# EAGLE design Jtracker (EAGLE 7.4.0)
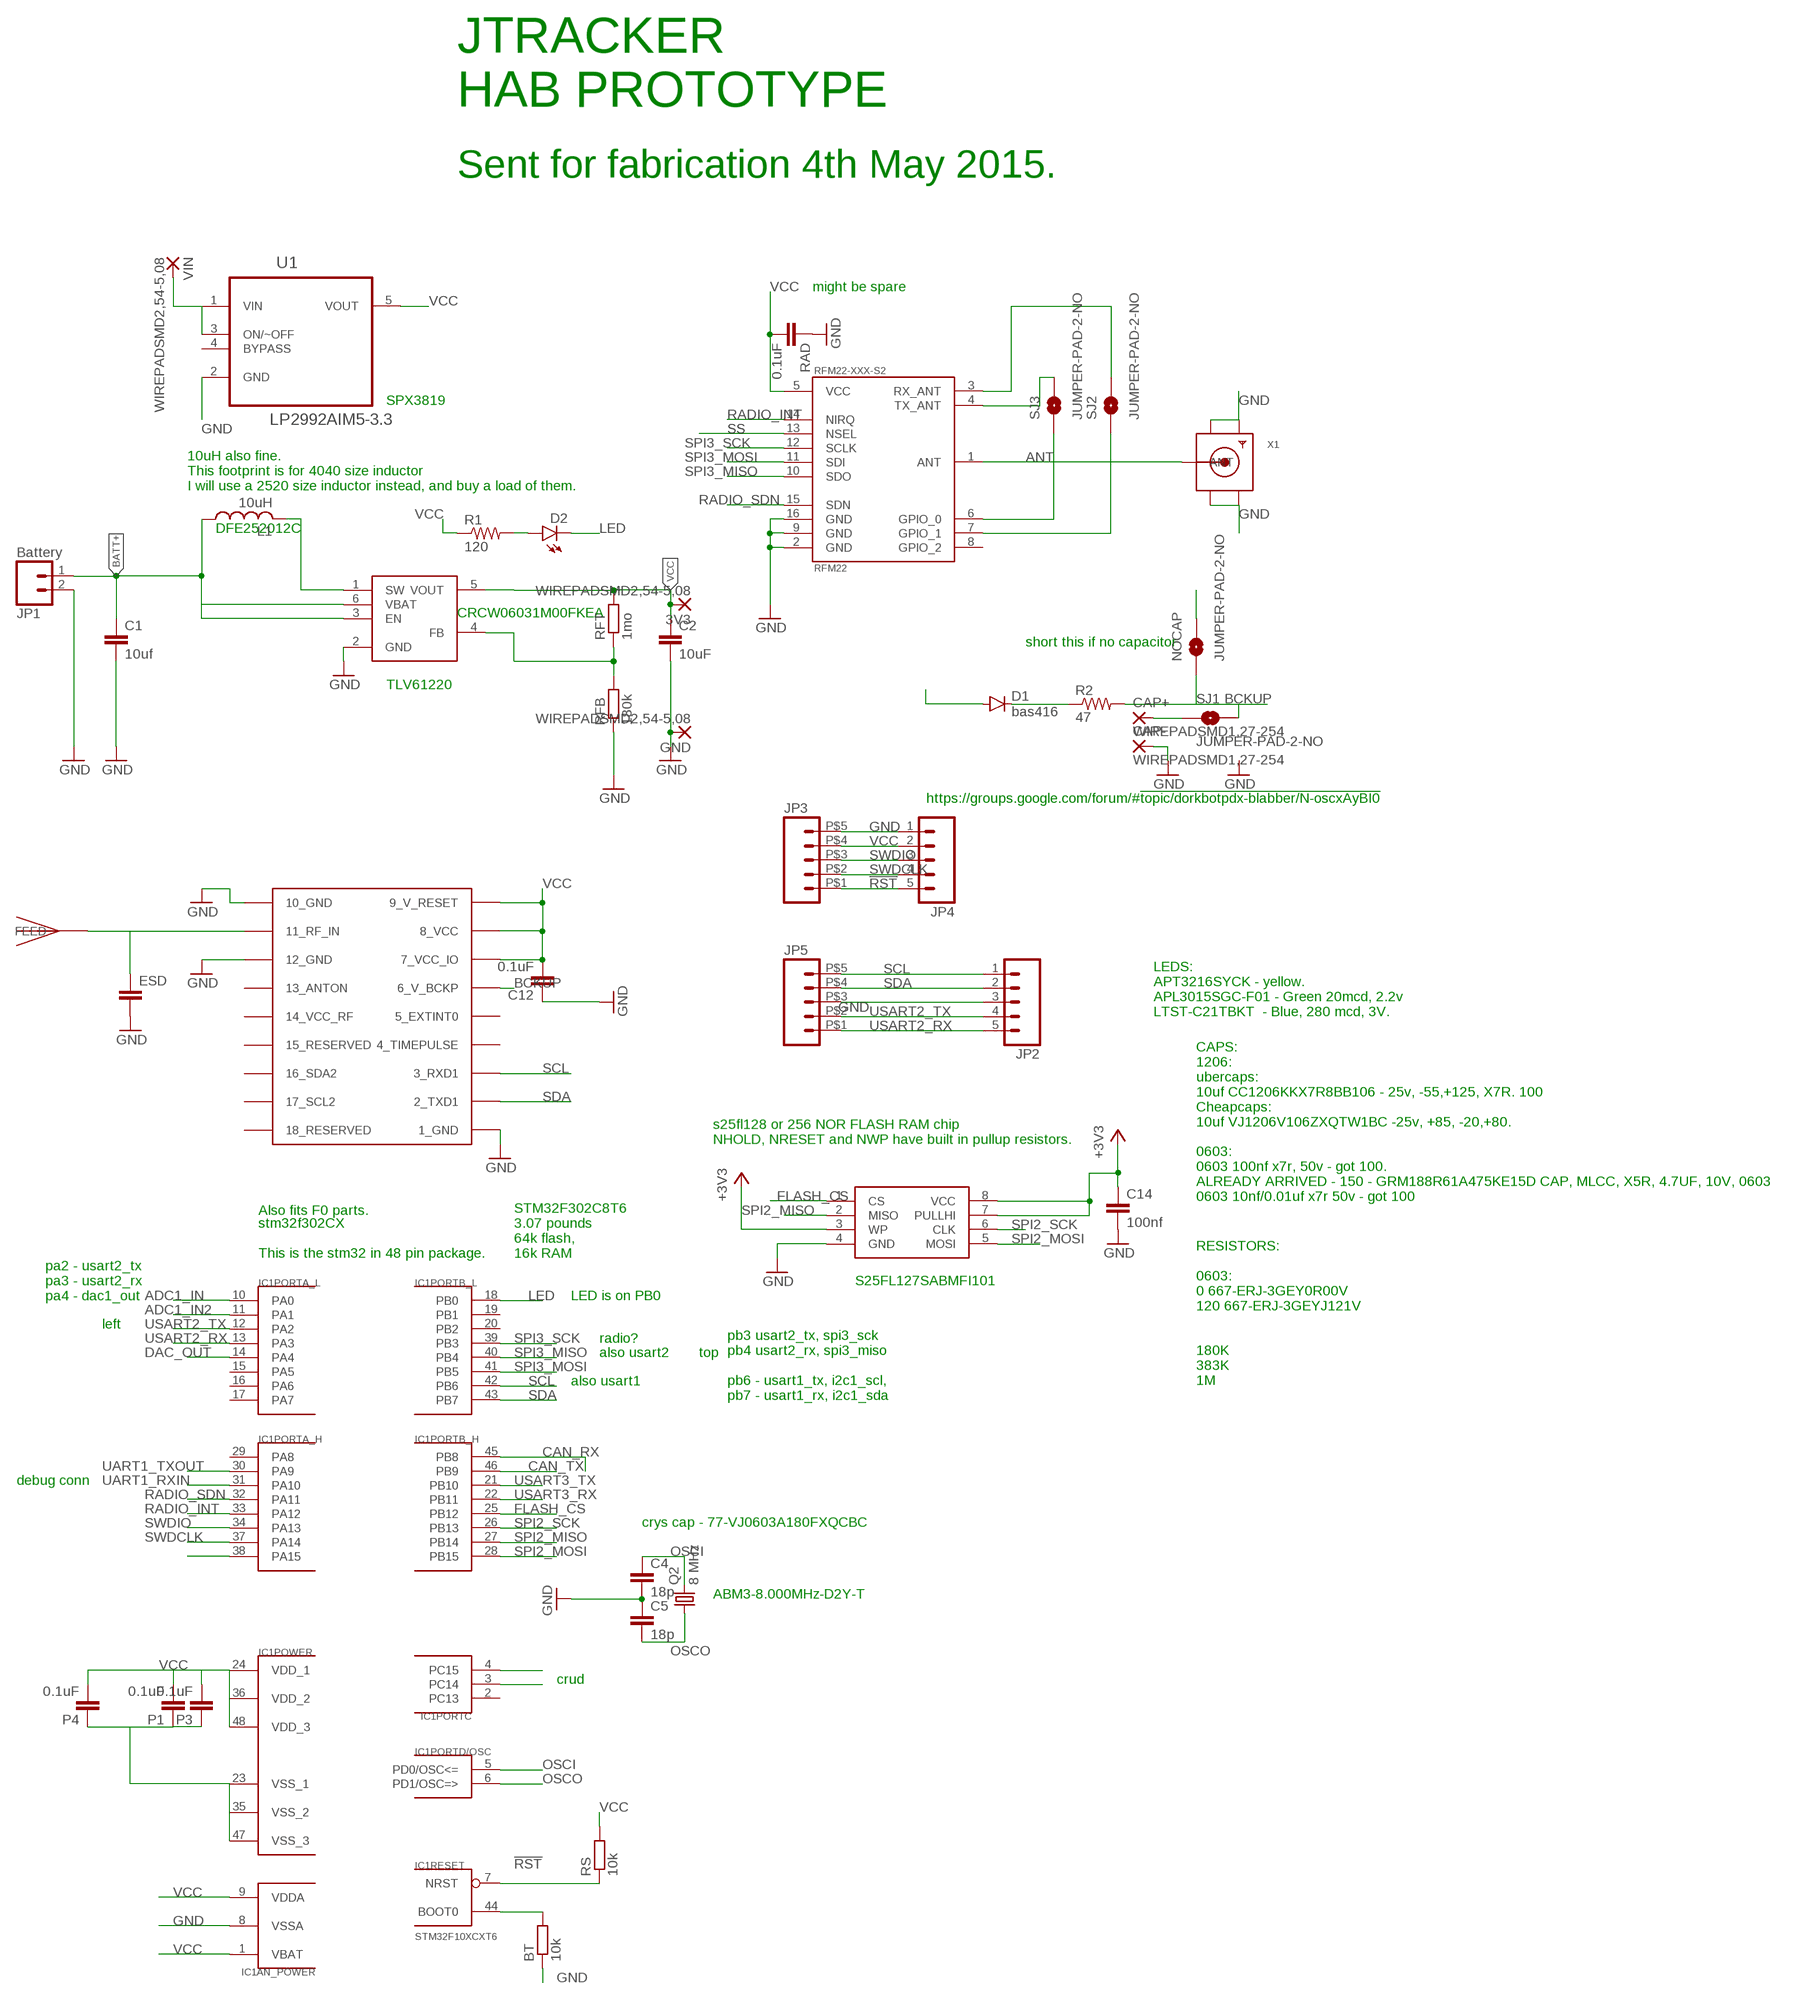
[diagram p0: schematic, sheet 1]

## Parts
3V3  WIREPADSMD2,54-5,08  [SMD2,54-5,08]
BT  10k  R-EU_R0603  [R0603]
C1  10uf  CAP1206  [1206]
C2  10uF  CAP1206  [1206]
C4  18p  C-EUC0603  [C0603]
C5  18p  C-EUC0603  [C0603]
C12  0.1uF  C-EUC0603  [C0603]
C14  100nf  CAP0603-CAP  [0603-CAP]
CAP+  WIREPADSMD1,27-254  [SMD1,27-2,54]
CAP-  WIREPADSMD1,27-254  [SMD1,27-2,54]
D1  bas416  DIODESOD123  [SOD-123]
D2  LED1206  [LED-1206]
ESD  CAP0603-CAP  [0603-CAP]
GND  WIREPADSMD2,54-5,08  [SMD2,54-5,08]
GPS_ANT  JTI_ANTENNA-1575AT43A40  [JTI_ANTENNA-1575AT43A40]
IC1  STM32F10XCXT6  [TQFP48]
JP1  Battery  M02PTH  [1X02]
JP2  M05NO_SILK  [1X05_NO_SILK]
JP3  M05  [5PADSMD]
JP4  M05NO_SILK  [1X05_NO_SILK]
JP5  M05  [5PADSMD]
L1  10uH  LLQH44P_P0  [LQH44]
MEM  S25FL127S_SOIC  [SOIC-8W]
NOCAP  JUMPER-PAD-2-NO  [PAD-JUMPER-2-NO_NO_SILK]
P1  0.1uF  C-EUC0603  [C0603]
P3  0.1uF  C-EUC0603  [C0603]
P4  0.1uF  C-EUC0603  [C0603]
Q2  8 MHz  ABRACON_ABM3_CRYSTAL  [ABRACON_ABM3_CRYSTAL]
R1  120  RESISTOR0603-RES  [0603-RES]
R2  47  RESISTOR0603-RES  [0603-RES]
RAD  0.1uF  C-EUC0603  [C0603]
RFB  180k  R-EU_R0603  [R0603]
RFM22-XXX-S2  RFM22  [RFM22-XXX-S2]
RFT  1mo  R-EU_R0603  [R0603]
RS  10k  R-EU_R0603  [R0603]
SJ1  JUMPER-PAD-2-NO  [PAD-JUMPER-2-NO_NO_SILK]
SJ2  JUMPER-PAD-2-NO  [PAD-JUMPER-2-NO_NO_SILK]
SJ3  JUMPER-PAD-2-NO  [PAD-JUMPER-2-NO_NO_SILK]
U1  LP2992AIM5-3.3  [SOT95P284X122-5N]
U$2  TLV61220  [SOT23-6]
U$3  UBLOX_MAX  [UBLOX_MAX]
VIN  WIREPADSMD2,54-5,08  [SMD2,54-5,08]
X1  SMACONNECTOR_EDGE_UFL  [SMA_EDGELAUNCH_UFL]

## Nets
!RST: IC1.7(RESET:NRST) JP3.P$1 JP4.5 RS.1
+3V3 [vcc]: MEM.3(WP)
ADC1_IN: IC1.10(PORTA_L:PA0)
ADC1_IN2: IC1.11(PORTA_L:PA1)
ANT [rf]: RFM22-XXX-S2.1(ANT) X1.P(ANT)
BATT+ [vcc]: C1.1 JP1.1 L1.P$1 U$2.3(EN) U$2.6(VBAT)
BCKUP: NOCAP.1 R2.2 SJ1.2 U$3.6_V_BCKP
CAN_RX: IC1.45(PORTB_H:PB8)
CAN_TX: IC1.46(PORTB_H:PB9)
DAC_OUT: IC1.14(PORTA_L:PA4)
FLASH_CS: IC1.25(PORTB_H:PB12) MEM.1(CS)
GND: BT.1 C1.2 C2.2 C4.2 C5.1 C12.1 C14.2 CAP-.1(P) ESD.2 GND.1(P) IC1.8(AN_POWER:VSSA) IC1.23(POWER:VSS_1) IC1.35(POWER:VSS_2) IC1.47(POWER:VSS_3) JP1.2 JP2.3 JP3.P$5 JP4.1 JP5.P$3 MEM.4(GND) P1.1 P3.1 P4.1 RAD.1 RFB.1 RFM22-XXX-S2.2(GND) RFM22-XXX-S2.9(GND) RFM22-XXX-S2.16(GND) U1.2(GND) U$2.2(GND) U$3.1_GND U$3.10_GND U$3.12_GND X1.GND@1(GND1) X1.GND@2(GND2) X1.GND@3(GND3) X1.GND@4(GND4)
GPS_ANT [rf]: ESD.1 GPS_ANT.FEED U$3.11_RF_IN
LED: D2.C IC1.18(PORTB_L:PB0)
N$1: D1.C R2.1
N$2: IC1.3(PORTC:PC14)
N$3: U1.1(VIN) U1.3(ON/~OFF) VIN.1(P)
N$4: IC1.4(PORTC:PC15)
N$5: BT.2 IC1.44(RESET:BOOT0)
N$6: RFM22-XXX-S2.4(TX_ANT) SJ3.2
N$7: RFM22-XXX-S2.3(RX_ANT) SJ2.2
N$8: L1.P$2 U$2.1(SW)
N$9: CAP+.1(P) SJ1.1
N$10: RFM22-XXX-S2.7(GPIO_1) SJ2.1
N$11: RFB.2 RFT.1 U$2.4(FB)
N$12: RFM22-XXX-S2.6(GPIO_0) SJ3.1
N$13: D2.A R1.2
OSCI: C4.1 IC1.5(PORTD/OSC:PD0/OSC<=) Q2.P$2
OSCO: C5.2 IC1.6(PORTD/OSC:PD1/OSC=>) Q2.P$1
RADIO_INT: IC1.33(PORTA_H:PA12) RFM22-XXX-S2.14(NIRQ)
RADIO_SDN: IC1.32(PORTA_H:PA11) RFM22-XXX-S2.15(SDN)
SCL: IC1.42(PORTB_L:PB6) JP2.1 JP5.P$5 U$3.3_RXD1
SDA: IC1.43(PORTB_L:PB7) JP2.2 JP5.P$4 U$3.2_TXD1
SPI2_MISO: IC1.27(PORTB_H:PB14) MEM.2(MISO)
SPI2_MOSI: IC1.28(PORTB_H:PB15) MEM.5(MOSI)
SPI2_SCK: IC1.26(PORTB_H:PB13) MEM.6(CLK)
SPI3_MISO: IC1.40(PORTB_L:PB4) RFM22-XXX-S2.10(SDO)
SPI3_MOSI: IC1.41(PORTB_L:PB5) RFM22-XXX-S2.11(SDI)
SPI3_SCK: IC1.39(PORTB_L:PB3) RFM22-XXX-S2.12(SCLK)
SS: IC1.38(PORTA_H:PA15) RFM22-XXX-S2.13(NSEL)
SWDCLK: IC1.37(PORTA_H:PA14) JP3.P$2 JP4.4
SWDIO: IC1.34(PORTA_H:PA13) JP3.P$3 JP4.3
UART1_RXIN: IC1.31(PORTA_H:PA10)
UART1_TXOUT: IC1.30(PORTA_H:PA9)
USART2_RX: IC1.13(PORTA_L:PA3) JP2.5 JP5.P$1
USART2_TX: IC1.12(PORTA_L:PA2) JP2.4 JP5.P$2
USART3_RX: IC1.22(PORTB_H:PB11)
USART3_TX: IC1.21(PORTB_H:PB10)
VCC: 3V3.1(P) C2.1 C12.2 C14.1 D1.A IC1.1(AN_POWER:VBAT) IC1.9(AN_POWER:VDDA) IC1.24(POWER:VDD_1) IC1.36(POWER:VDD_2) IC1.48(POWER:VDD_3) JP3.P$4 JP4.2 MEM.7(PULLHI) MEM.8(VCC) NOCAP.2 P1.2 P3.2 P4.2 R1.1 RAD.2 RFM22-XXX-S2.5(VCC) RFT.2 RS.2 U1.5(VOUT) U$2.5(VOUT) U$3.7_VCC_IO U$3.8_VCC U$3.9_V_RESET ; supply symbol labelled +3V3
Unconnected: IC1.2(PORTC:PC13) IC1.15(PORTA_L:PA5) IC1.16(PORTA_L:PA6) IC1.17(PORTA_L:PA7) IC1.19(PORTB_L:PB1) IC1.20(PORTB_L:PB2) IC1.29(PORTA_H:PA8) RFM22-XXX-S2.8(GPIO_2) U1.4(BYPASS) U$3.4_TIMEPULSE U$3.5_EXTINT0 U$3.13_ANTON U$3.14_VCC_RF U$3.15_RESERVED U$3.16_SDA2 U$3.17_SCL2 U$3.18_RESERVED

## Notes on the sheet
- JTRACKER 
  HAB PROTOTYPE
- Sent for fabrication 4th May 2015.
- might be spare
- SPX3819
- 10uH also fine. 
  This footprint is for 4040 size inductor
  I will use a 2520 size inductor instead, and buy a load of them.
- DFE252012C
- CRCW06031M00FKEA
- short this if no capacitor
- TLV61220
- https://groups.google.com/forum/#!topic/dorkbotpdx-blabber/N-oscxAyBI0
- LEDS:
  APT3216SYCK - yellow. 
  APL3015SGC-F01 - Green 20mcd, 2.2v
  LTST-C21TBKT  - Blue, 280 mcd, 3V.
- s25fl128 or 256 NOR FLASH RAM chip
  NHOLD, NRESET and NWP have built in pullup resistors.
- CAPS:
  1206:
  ubercaps:
  10uf CC1206KKX7R8BB106 - 25v, -55,+125, X7R. 100
  Cheapcaps:
  10uf VJ1206V106ZXQTW1BC -25v, +85, -20,+80.
  
  0603:
  0603 100nf x7r, 50v - got 100. 
  ALREADY ARRIVED - 150 - GRM188R61A475KE15D CAP, MLCC, X5R, 4.7UF, 10V, 0603
  0603 10nf/0.01uf x7r 50v - got 100
- Also fits F0 parts.
- stm32f302CX
  
  This is the stm32 in 48 pin package.
- STM32F302C8T6 
  3.07 pounds
  64k flash,
  16k RAM
- pa2 - usart2_tx
  pa3 - usart2_rx
  pa4 - dac1_out
- LED is on PB0 | S25FL127SABMFI101
- left
- radio?
- also usart2 | top
- also usart1
- pb3 usart2_tx, spi3_sck
  pb4 usart2_rx, spi3_miso
  
  pb6 - usart1_tx, i2c1_scl,
  pb7 - usart1_rx, i2c1_sda
- RESISTORS:
  
  0603:
  0 667-ERJ-3GEY0R00V 
  120 667-ERJ-3GEYJ121V 
  
  
  180K
  383K
  1M
- debug conn
- crys cap - 77-VJ0603A180FXQCBC
- ABM3-8.000MHz-D2Y-T
- crud

## Library data of the parts
3V3 CAP+ CAP- GND VIN = wirepad:WIREPAD: Wire PAD connect wire on PCB
BT RFB RFT RS = resistor:R-EU_: RESISTOR, European symbol
C1 C2 C14 ESD = SparkFun-Capacitors:CAP: Capacitor Standard 0603 ceramic capacitor, and 0.1" leaded capacitor.
C4 C5 C12 P1 P3 P4 RAD = resistor:C-EU: CAPACITOR, European symbol
D1 = SparkFun-DiscreteSemi:DIODE: Diode These are standard reverse protection diodes and small signal diodes. SMA package can handle up to about 1A. SOD-323 can handle about 200mA. What the SOD-323 package when ordering, there are some mfgs out there that are 5-pin packages.
D2 = SparkFun-LED:LED: LEDs Standard schematic elements and footprints for 5mm, 3mm, 1206, and 0603 sized LEDs. 5mm - Spark Fun Electronics SKU : COM-00529 (and others)
GPS_ANT = ava:JTI_ANTENNA-1575AT43A40
IC1 = stm32:STM32F10XCXT6: ST STM32F101/103 48pin LQFP
JP1 = SparkFun:M02: Header 2 Standard 2-pin 0.1" header. Use with straight break away headers (SKU : PRT-00116), right angle break away headers (PRT-00553), swiss pins (PRT-00743), machine pins (PRT-00117), and female headers (PRT-00115). Molex polarized connector foot print use with SKU : PRT-08233 with associated crimp pins and housings.
JP2-JP5 = James:M05: Header 5 Standard 5-pin 0.1" header. Use with straight break away headers (SKU : PRT-00116), right angle break away headers (PRT-00553), swiss pins (PRT-00743), machine pins (PRT-00117), and female headers (PRT-00115). Molex polarized connector foot print use with SKU : PRT-08230 with associated crimp pins and housings.
L1 = karlnet-parts:L
MEM = James:S25FL127S_SOIC: S25FL127S 128MB FLASH MEMORY
NOCAP SJ1-SJ3 = SparkFun-Passives:JUMPER-PAD-2-NO
Q2 = ava:ABRACON_ABM3_CRYSTAL
R1 R2 = SparkFun-Passives:RESISTOR: Resistor Basic schematic elements and footprints for 0603, 1206, and PTH resistors.
RFM22-XXX-S2 = SparkFun:RFM22: *Hope RF's RFM22* Packages: RFM22-S2 (SMD)
U1 = James:LP2992AIM5-3.3: Low-Dropout Regulator; MPN: LP2992AIM5-3.3; OC_FARNELL: 1469139; OC_NEWARK: 74C5317; PACKAGE: SOT23-5; SUPPLIER: National Semiconductor
U$2 = James:TLV61220: TLV61220 boost converter sot23 james
U$3 = ava:UBLOX_MAX: UBLOX MAX
X1 = adafruit:SMACONNECTOR: SMA Connector 90° DIP SMA Connector, 50 Ohm (4UConnector: 07259)

## Net classes
0 default: width 0.152 mm, clearance 0.254 mm
1 vcc: width 0.254 mm

## Board
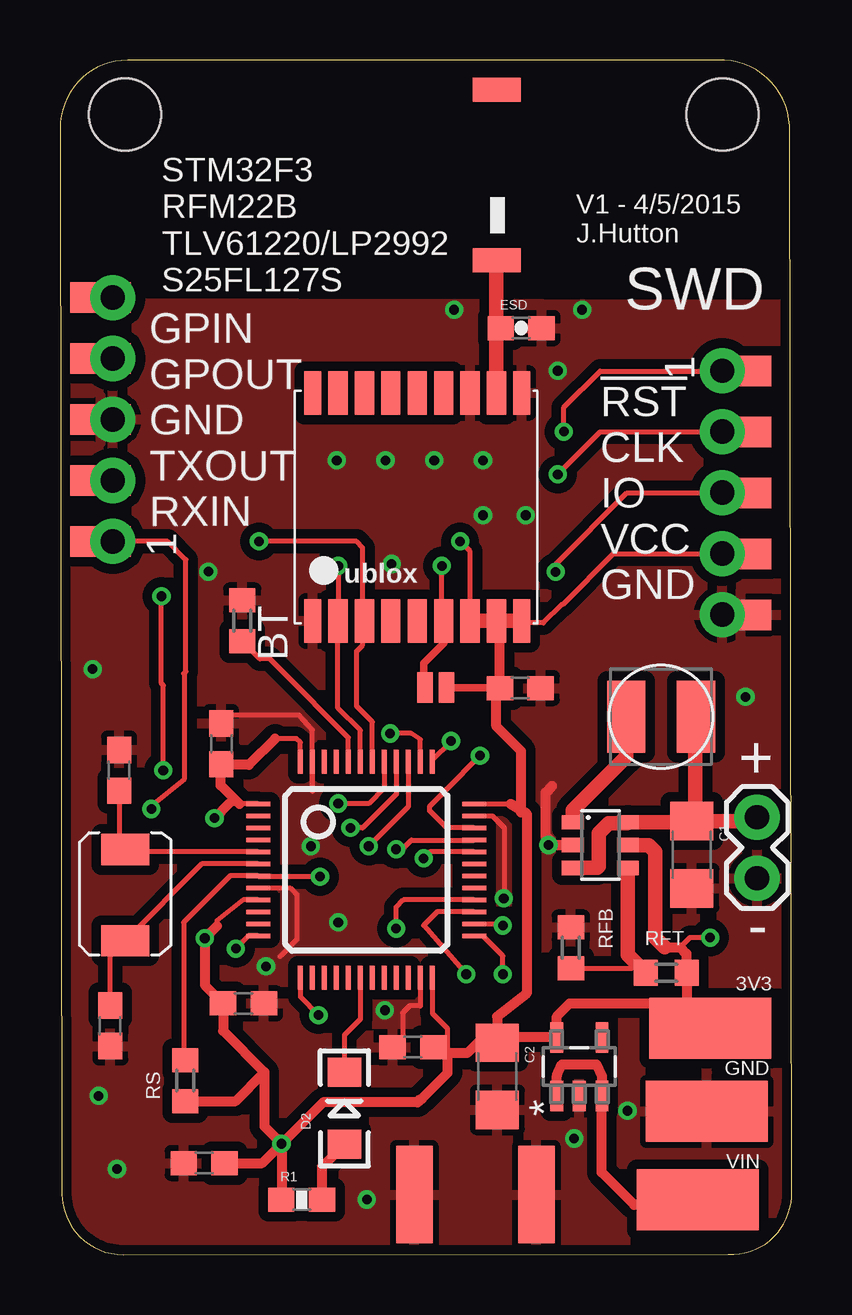
[diagram p1: board, top side]
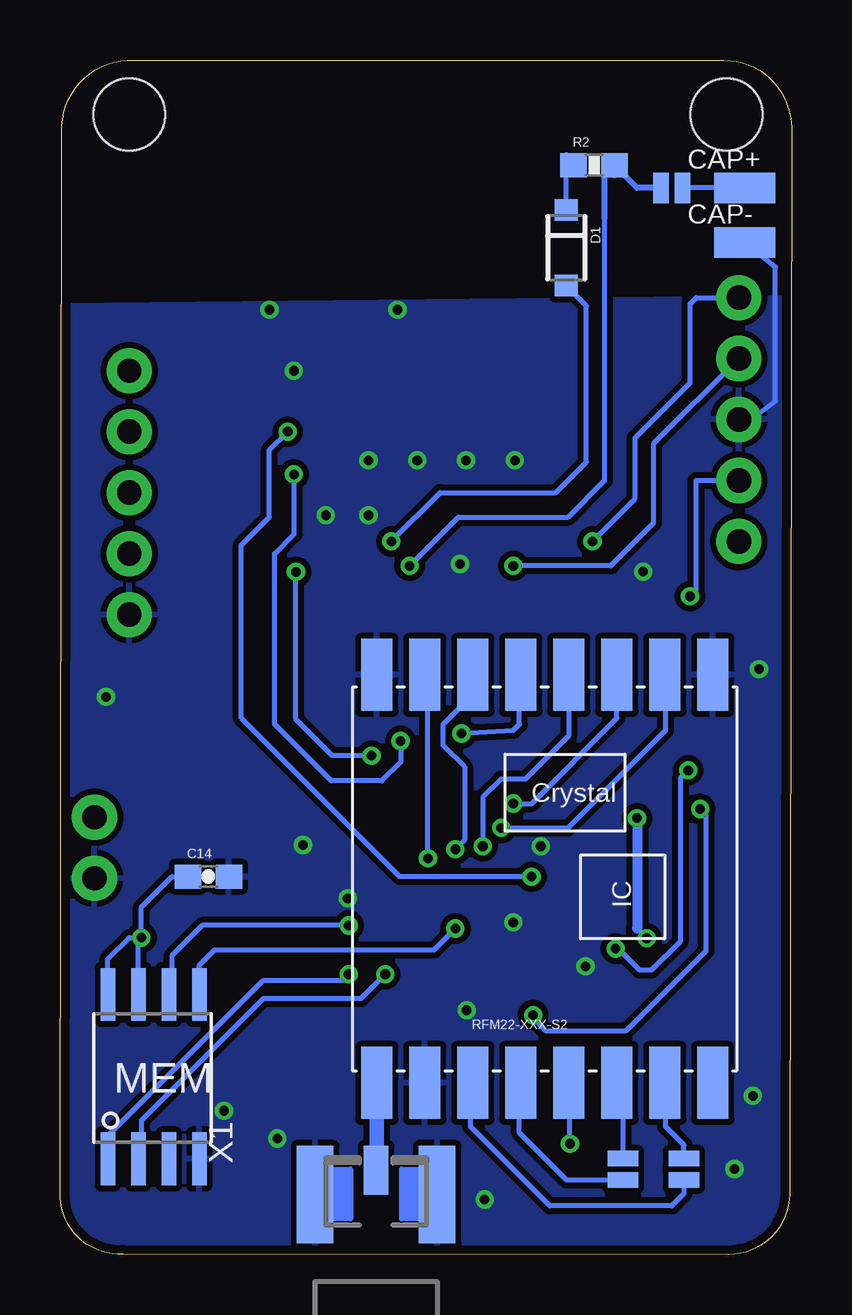
[diagram p2: board, bottom side, seen from below]

Size 30.48 x 49.78 mm. Coordinates in mm from the lower left corner, seen from the top.
Outline: 0,46.94 0.08,2.54 arc90 2.63,0 27.85,0.01 arc90 30.48,2.4 30.4,47.03 arc90 27.4,49.78 2.82,49.77 arc90 0,46.94
Copper layers (1*16): Top 0.0356mm / dielectric 1.5011mm / Bottom 0.0356mm
Design rules "LaenPCBOrder": minimum track width 6mil, minimum drill 13mil, track to track 6mil, track to pad 6mil, pad to pad 6mil, via to via 6mil, smd to smd 6mil, copper to edge 15mil, drill to drill 6mil, minimum pad ring 7mil, minimum via ring 7mil, stop-mask expansion 3mil, vias tented up to drill 0mil, thermal gap 10mil
Holes 3 mm at 27.6,47.5 2.7,47.5

### Footprints (pad centres in the part's own frame; a part is rotated, then mirrored left to right if it is on the bottom)
SMD2,54-5,08 = smd 2.54 x 5.08: 1 0,0
R0603 = smd 1 x 1.1: 1 -0.85,0; 2 0.85,0
1206 = smd 1.6 x 1.8: 1 -1.4,0; 2 1.4,0
C0603 = smd 1.1 x 1: 1 -0.85,0; 2 0.85,0
0603-CAP = smd 1.1 x 1: 1 -0.85,0; 2 0.85,0
SMD1,27-2,54 = smd 1.27 x 2.54: 1 0,0
SOD-123 = smd 0.9 x 0.95: A 1.575,0; C -1.575,0
LED-1206 = smd 1.2 x 1.4: A -1.5,0; C 1.5,0
JTI_ANTENNA-1575AT43A40 = smd 1 x 2: FEED -3.175,0; NC 3.925,0
TQFP48 = smd 0.2 x 1: 1 -2.75,-4.5; 2 -2.25,-4.5; 3 -1.75,-4.5; 4 -1.25,-4.5; 5 -0.75,-4.5; 6 -0.25,-4.5; 7 0.25,-4.5; 8 0.75,-4.5; 9 1.25,-4.5; 10 1.75,-4.5; 11 2.25,-4.5; 12 2.75,-4.5; 25 2.75,4.5; 26 2.25,4.5; 27 1.75,4.5; 28 1.25,4.5; 29 0.75,4.5; 30 0.25,4.5; 31 -0.25,4.5; 32 -0.75,4.5; 33 -1.25,4.5; 34 -1.75,4.5; 35 -2.25,4.5; 36 -2.75,4.5 | smd 1 x 0.2: 13 4.5,-2.75; 14 4.5,-2.25; 15 4.5,-1.75; 16 4.5,-1.25; 17 4.5,-0.75; 18 4.5,-0.25; 19 4.5,0.25; 20 4.5,0.75; 21 4.5,1.25; 22 4.5,1.75; 23 4.5,2.25; 24 4.5,2.75; 37 -4.5,2.75; 38 -4.5,2.25; 39 -4.5,1.75; 40 -4.5,1.25; 41 -4.5,0.75; 42 -4.5,0.25; 43 -4.5,-0.25; 44 -4.5,-0.75; 45 -4.5,-1.25; 46 -4.5,-1.75; 47 -4.5,-2.25; 48 -4.5,-2.75
1X02 = drill 1.016 pad 1.88: 1 0,0; 2 2.54,0
1X05_NO_SILK = drill 1.016 pad 1.88: 1 0,0; 2 2.54,0; 3 5.08,0; 4 7.62,0; 5 10.16,0
5PADSMD = smd 1.27 x 2.54: P$1 -5.08,1.27; P$2 -2.54,1.27; P$3 0,1.27; P$4 2.54,1.27; P$5 5.08,1.27
LQH44 = smd 1.6 x 3: P$1 -1.45,0; P$2 1.45,0
SOIC-8W = smd 0.6 x 2.2: 1 -1.905,-3.376; 2 -0.635,-3.376; 3 0.635,-3.376; 4 1.905,-3.376; 5 1.905,3.475; 6 0.635,3.475; 7 -0.635,3.475; 8 -1.905,3.475
PAD-JUMPER-2-NO_NO_SILK = smd 0.635 x 1.27: 1 -0.45,0; 2 0.45,0
ABRACON_ABM3_CRYSTAL = smd 1.3 x 2: P$1 -3.4,0.1; P$2 0.4,0.1
0603-RES = smd 1.1 x 1: 1 -0.85,0; 2 0.85,0
RFM22-XXX-S2 = smd 3 x 1.3: 1 -8.5,7; 2 -8.5,5; 3 -8.5,3; 4 -8.5,1; 5 -8.5,-1; 6 -8.5,-3; 7 -8.5,-5; 8 -8.5,-7; 9 8.5,-7; 10 8.5,-5; 11 8.5,-3; 12 8.5,-1; 13 8.5,1; 14 8.5,3; 15 8.5,5; 16 8.5,7
SOT95P284X122-5N = smd 1.27 x 0.533: 1 -1.219,0.94; 2 -1.219,0; 3 -1.219,-0.94; 4 1.219,-0.94; 5 1.219,0.94
SOT23-6 = smd 0.6 x 0.9: 1 -0.95,-1.15; 2 0,-1.15; 3 0.95,-1.15; 4 0.95,1.15; 5 0,1.15; 6 -0.95,1.15
UBLOX_MAX = smd 1.8 x 0.7: 1_GND 4.95,-4.4; 9_V_RESET 4.95,4.3; 10_GND -4.55,4.3; 18_RESERVED -4.55,-4.4 | smd 1.8 x 0.8: 2_TXD1 4.95,-3.35; 3_RXD1 4.95,-2.25; 4_TIMEPULSE 4.95,-1.15; 5_EXTINT0 4.95,-0.05; 6_V_BCKP 4.95,1.05; 7_VCC_IO 4.95,2.15; 8_VCC 4.95,3.25; 11_RF_IN -4.55,3.25; 12_GND -4.55,2.15; 13_ANTON -4.55,1.05; 14_VCC_RF -4.55,-0.05; 15_RESERVED -4.55,-1.15; 16_SDA2 -4.55,-2.25; 17_SCL2 -4.55,-3.35
SMA_EDGELAUNCH_UFL = smd 4.064 x 1.524: GND@1 2.032,-2.54; GND@2 2.032,2.54 | smd 4.064 x 1.524 bottom: GND@3 2.032,2.54; GND@4 2.032,-2.54 | smd 2.032 x 1.016: P 3.048,0

### Placement (x,y rotation side)
3V3  27.09,9.44 270 top
BT  7.59,26.41 270 top
C1  26.33,16.66 270 top
C2  18.22,7.43 270 top
C4  2.46,20.18 90 top
C5  2.09,9.54 90 top
C12  19.18,23.61 180 top
C14  24.29,15.75 0 bottom
CAP+  1.94,44.45 270 bottom
CAP-  1.94,42.16 270 bottom
D1  9.38,41.95 270 bottom
D2  11.85,6.09 90 top
ESD  19.21,38.61 0 top
GND  26.95,5.97 90 top
GPS_ANT  18.2,44.61 90 top
IC1  12.76,16.03 270 top
JP1  29.04,18.22 270 top
JP2  2.2,39.88 270 top
JP3  27.09,31.74 270 top
JP4  27.6,26.67 90 top
JP5  2.96,34.8 90 top
L1  25.04,22.41 180 top
MEM  26.58,7.36 0 bottom
NOCAP  15.66,23.62 0 top
P1  6.72,21.28 270 top
P3  14.71,8.65 0 top
P4  7.64,10.46 180 top
Q2  2.82,16.48 90 top
R1  10.07,2.28 0 top
R2  8.23,45.39 0 bottom
RAD  6.01,3.81 0 top
RFB  21.28,12.79 270 top
RFM22-XXX-S2  10.29,15.66 90 bottom
RFT  25.26,11.75 0 top
RS  5.22,7.25 270 top
SJ1  4.99,44.45 180 bottom
SJ2  4.48,3.55 270 bottom
SJ3  7.02,3.55 270 bottom
U1  21.64,7.83 90 top
U$2  22.52,17.07 270 top
U$3  14.93,31.35 270 top
VIN  26.58,2.28 270 top
X1  17.31,0.47 90 bottom

### Tracks (layer width: path | path; a pad name or v marks a point on that pad's centre or on a via)
!RST  (via drill 0.4)
  Top 0.2: RS.1 5.21,8.11 5.21,8.44 5.15,8.49 5.15,13.84 7.09,15.78 IC1.7 8.29,15.75 v10.83,15.75 | v20.99,34.29 20.99,35.3 22.5,36.82 JP3.P$1 27.61,36.82 JP4.5
  Bottom 0.2: v20.99,34.29 21.75,33.53 21.75,30.73 22.92,29.56 22.92,22.35 16.32,15.75 v10.83,15.75
ANT
  Bottom 0.6: RFM22-XXX-S2.1 17.29,3.22 X1.P
BATT+
  Top 0.61: C1.1 25.81,18.02 U$2.6 23.63,17.98 22.87,17.98 22.45,17.56 22.45,16.19 22.38,16.12 U$2.3 | C1.1 28.88,18.06 JP1.1 | L1.P$1 26.48,22.4 26.48,18.21 C1.1
BCKUP  (via drill 0.4)
  Top 0.2: U$3.6_V_BCKP 15.91,26.48 v15.91,28.7
  Top 0.305: U$3.6_V_BCKP 15.98,25.47 15.15,24.64 15.15,23.68 NOCAP.1
  Bottom 0.2: 7.78,43.18 7.78,32.26 9.31,30.73 13.88,30.73 v15.91,28.7
  Bottom 0.254: 7.38,44.96 R2.2 | 7.78,43.18 7.78,44.98 R2.2 | SJ1.2 6.44,44.45 R2.2
FLASH_CS  (via drill 0.4)
  Top 0.2: v18.45,11.68 18.45,12.44 17.62,13.28 IC1.25
  Bottom 0.2: MEM.1 28.48,4.95 22.01,11.43 18.71,11.43 v18.45,11.68
GND  (via drill 0.4)
  Top 0.2: P1.1 7.06,22.48 9.97,22.48 10.51,21.87 10.51,19.3 10.51,19.37 IC1.47 | IC1.23 15.01,10.36 | 15.01,10.36 | IC1.35 18.02,18.28 18.5,17.79 18.5,14.87 v18.49,14.84 | IC1.8 9.59,15.28 9.87,15 9.87,13.13 9.17,12.43 | 15.01,10.36 14.57,10.36 14.27,10.07 14.27,8.55 P3.1
  Top 0.406: U$2.2 20.59,17.07 20.23,17.42 20.23,19.25 20.51,19.53
  Bottom 0.2: JP2.3 JP5.P$3 0.67,35.56 0.67,41.15 CAP-.1
  other vias: 17.63,30.81 8.58,12.01 21.42,4.84 23.65,5.99 28.56,23.24 20.36,17.07 12.79,2.3 1.36,24.4 13.54,10.18 1.61,6.62 17.63,33.1 15.59,33.1 13.56,33.1 11.53,33.1 19.4,30.81 13.82,28.78 10.45,17.02 11.59,13.84 16.42,39.37 21.75,39.37 20.74,36.83 2.37,3.57 6.18,28.46
  pour Top (isolate 0.406): 30.94,0.32 30.31,39.57 -0.26,39.64 0.37,0.38
  pour Bottom: 0.02,39.85 30.52,39.52 30.5,-0.38 0.01,-0.05
GPS_ANT
  Top 0.61: GPS_ANT.FEED 18.18,41.17 18.18,39.04 ESD.1 18.18,38.68 U$3.11_RF_IN
LED
  Top 0.2: IC1.18 12.51,9.81 11.85,9.14 D2.C
N$1
  Bottom 0.2: D1.C 9.38,45.85 R2.1
N$3
  Top 0.2: 22.57,6.6 U1.3
  Top 0.406: VIN.1 23.93,2.07 22.57,3.43 22.57,6.6 | U1.1 20.7,7.45 20.92,7.92 22.35,7.92 22.58,7.44 U1.3
N$5
  Top 0.2: IC1.44 12.01,21.54 10.62,22.93 10.62,22.95 8.74,24.83 8.33,24.83 BT.2
N$6
  Bottom 0.2: SJ3.2 9.37,3.1 11.34,5.08 11.34,7.1 RFM22-XXX-S2.4
N$7
  Bottom 0.2: SJ2.2 4.48,2.54 4.99,2.03 10.07,2.03 13.37,5.33 13.37,7.07 RFM22-XXX-S2.3
N$8
  Top 0.2: 23.6,21.84 23.63,21.88 23.63,22.37 L1.P$2
  Top 0.61: U$2.1 21.37,18.51 23.6,20.74 23.6,21.84
N$9
  Bottom 0.2: CAP+.1 SJ1.1
N$10
  Bottom 0.2: SJ2.1 4.48,4.57 5.24,5.33 5.24,7.12 RFM22-XXX-S2.7
N$11
  Top 0.2: RFT.1 24.03,12.13 23.84,11.94 RFB.2
  Top 0.61: U$2.4 23.67,12.49 24.03,12.13
N$12
  Bottom 0.2: SJ3.1 7.02,6.89 RFM22-XXX-S2.6
N$13
  Top 0.406: R1.2 10.92,3.67 D2.A
OSCI
  Top 0.2: IC1.5 2.83,16.78 Q2.P$2 2.46,17.14 C4.1
OSCO
  Top 0.2: IC1.6 5.91,16.28 Q2.P$1 2.09,12.46 C5.2
RADIO_INT  (via drill 0.4)
  Top 0.2: v14.01,16.89 14.26,16.89 14.64,17.27 IC1.33
  Bottom 0.2: RFM22-XXX-S2.14 13.29,23.45 13.63,23.11 13.63,22.99 14.51,22.1 14.51,21.21 13.63,20.32 13.63,17.27 v14.01,16.89
RADIO_SDN  (via drill 0.4)
  Top 0.2: IC1.32 15.42,16.78 v15.15,16.51
  Bottom 0.2: v15.15,16.51 15.15,24.02 RFM22-XXX-S2.15
SCL  (via drill 0.4)
  Top 0.2: v8.29,29.72 12.36,29.72 12.61,29.46 12.61,26.48 U$3.3_RXD1 12.61,26.33 12.61,25.4 12.36,25.14 12.36,22.86 13.01,22.2 IC1.42 | JP2.1 JP5.P$5
  Bottom 0.2: v8.29,29.72 6.51,31.49 6.51,34.03 4.23,36.32 4.23,39.62 3.97,39.88 JP2.1
SDA  (via drill 0.4)
  Top 0.2: IC1.43 12.51,21.84 11.58,22.77 U$3.2_TXD1 v11.58,28.69 v11.59,28.7 | JP2.2 JP5.P$4
  Bottom 0.2: JP2.2 5.75,33.78 5.75,30.48 7.53,28.7 v11.59,28.7
SPI2_MISO  (via drill 0.4)
  Top 0.2: IC1.27 15.71,14.28 15.15,13.71 v16.93,11.68
  Bottom 0.2: v16.93,11.68 17.94,10.67 22.01,10.67 27.09,5.59 27.09,4.12 MEM.2
SPI2_MOSI  (via drill 0.4)
  Top 0.2: v14.01,13.59 14.01,14.48 14.31,14.78 IC1.28
  Bottom 0.2: MEM.5 24.67,12.06 24.04,12.7 14.9,12.7 v14.01,13.59
SPI2_SCK  (via drill 0.4)
  Top 0.2: IC1.26 18.39,13.78 v18.45,13.71
  Bottom 0.2: v18.45,13.71 24.55,13.71 25.82,12.44 25.82,10.97 MEM.6
SPI3_MISO  (via drill 0.4)
  Top 0.2: IC1.40 14.01,19.18 12.61,17.78 v12.1,17.78
  Bottom 0.2: v12.1,17.78 9.31,17.78 5.24,21.84 5.24,24.12 RFM22-XXX-S2.10
SPI3_MOSI  (via drill 0.4)
  Top 0.2: IC1.41 13.51,19.44 12.86,18.79 v11.59,18.79
  Bottom 0.2: v11.59,18.79 10.83,18.79 7.28,22.35 7.28,24.15 RFM22-XXX-S2.11
SPI3_SCK  (via drill 0.4)
  Top 0.2: v12.86,17.02 14.51,18.66 IC1.39
  Bottom 0.2: RFM22-XXX-S2.12 9.29,21.61 11.09,19.81 12.1,19.81 12.86,19.05 v12.86,17.02
SS  (via drill 0.4)
  Top 0.2: IC1.38 15.01,21.47 14.64,21.72 v13.75,21.72
  Bottom 0.2: v13.75,21.72 11.59,21.84 11.34,22.1 11.34,24.1 RFM22-XXX-S2.13
SWDCLK  (via drill 0.4)
  Top 0.2: IC1.37 15.51,20.62 v16.29,21.4 | v20.74,32.51 22.5,34.28 JP3.P$2 28.34,34.29 JP4.4
  Bottom 0.2: v16.29,21.4 16.29,20.51 17.07,19.73 19.18,19.73 21.54,22.1 21.54,29.21 20.74,30.01 v20.74,32.51
SWDIO  (via drill 0.4)
  Top 0.2: IC1.34 16.12,17.78 15.4,18.49 15.4,18.68 16.8,20.08 16.8,20.09 v17.5,20.79 | v20.65,28.45 20.65,28.76 23.62,31.74 JP3.P$3 27.61,31.74 JP4.3
  Bottom 0.2: v17.5,20.79 19.14,20.79 20.65,22.3 v20.65,28.45
USART2_RX  (via drill 0.4)
  Top 0.2: IC1.13 10.01,10.74 v10.77,9.98 | v3.81,18.57 3.81,18.71 5.19,19.84 5.19,24.2 5.15,24.2 5.24,24.29 5.24,28.95 4.48,29.72 JP2.5 JP5.P$1
  Bottom 0.2: v10.77,9.98 10.77,9.84 10.26,9.33 6.88,9.33 3.55,12.66 3.55,18.31 v3.81,18.57
USART2_TX  (via drill 0.4)
  Top 0.2: IC1.12 7.85,13.28 v7.33,12.75 | v4.3,20.18 4.3,23.72 4.23,23.8 v4.23,27.43 | JP2.4 JP5.P$2
  Bottom 0.2: v7.33,12.75 7.22,12.75 6.34,11.86 5.83,11.86 4.62,13.07 4.62,19.86 v4.3,20.18 | v4.23,27.43 3.97,27.68 3.97,32.26 JP2.4
VCC  (via drill 0.4)
  Top 0.2: 7.47,18.78 IC1.1 7.03,18.78 | 6.69,20.41 P1.2 6.74,20.41 | IC1.48 10.01,21.34 9.85,21.5 8.96,21.5 | IC1.36 18.77,18.78 | IC1.24 15.51,10.05 16.14,9.42 16.14,8.38 P3.2 | 16.15,8.39 P3.2 | 26.29,10.46 26.59,10.46 26.86,10.2 27.11,10.2 3V3.1 | U$2.5 23.65,17.03 | 26.1,11.76 RFT.2 | U$3.9_V_RESET 19.31,26.33 20.14,26.33 20.9,27.09 20.94,27.09 23.05,29.2 JP3.P$4 27.61,29.2 JP4.2 | IC1.9 7.63,14.78 6.54,13.92 6.54,13.69 | 16.15,8.37 P3.2 | 9.29,4.68 v9.23,4.62 | U$3.7_VCC_IO 17.08,29.31 v16.67,29.72 | v27.09,13.21 26.25,13.21 25.84,12.8
  Top 0.25: 18.45,9.05 C2.1 18.21,8.84
  Top 0.305: NOCAP.2 18.31,23.62 C12.2
  Top 0.4: 18,9.05 C2.1
  Top 0.406: 7.47,18.78 6.69,19.56 6.69,20.41 | 8.96,21.5 7.87,20.41 6.74,20.41 | 18.45,9.05 U1.5 20.7,9.93 21.23,10.46 26.29,10.46 26.11,10.64 RFT.2 | 16.15,8.39 16.97,8.39 17.63,9.05 18,9.05 | 25.2,12.8 25.84,12.8 26.1,12.55 26.1,11.76 | RS.2 7.31,6.4 8.51,7.6 | 8.51,7.6 6.79,9.32 P4.2 6.03,11.23 v6.03,13.18 6.54,13.69 | 7.03,18.78 v6.44,18.18 | 16.15,8.37 16.15,7.57 15.07,6.49 15.04,6.49 14.9,6.35 10.96,6.35 v9.23,4.62 | 19.44,18.39 19.44,10.87 18.21,9.92 18.21,8.84 | 19.44,18.39 19.2,18.43 19.2,20.99 18.18,22.01 18.18,23.47 C12.2 | 8.51,7.6 8.51,5.34 v9.23,4.62 | 18.77,18.78 19.44,18.39 | v9.23,4.62 9.23,2.04 R1.1 | C12.2 18.33,26.26 U$3.8_VCC | 18.06,23.87 C12.2 | RAD.2 8.42,3.81 v9.23,4.62
  Top 0.61: U$3.7_VCC_IO U$3.8_VCC U$3.9_V_RESET | U$2.5 24.52,17.07 24.8,16.79 24.8,13.19 25.2,12.8
  Bottom 0.2: 6.44,13.59 v6.03,13.18 | v9.23,4.62 9.23,6.85 RFM22-XXX-S2.5 | v16.67,29.72 14.64,31.75 9.82,31.75 8.55,33.02 8.55,39.53 D1.A | MEM.7 27.21,13.08 v27.09,13.21 | MEM.8 28.48,12.32 27.6,13.21 v27.09,13.21 | v27.09,13.21 27.09,14.48 25.82,15.75 C14.1
  Bottom 0.406: v6.44,18.18 6.44,13.59

### Text on the board
tNames: V1 - 4/5/2015 / J.Hutton | STM32F3 / RFM22B / TLV61220/LP2992 / S25FL127S | SWD | GPIN / GPOUT / GND / TXOUT / RXIN | !RST / CLK / IO / VCC / GND | + | -